# EAGLE design stuffed_teensy_ss (EAGLE 9.5.2)
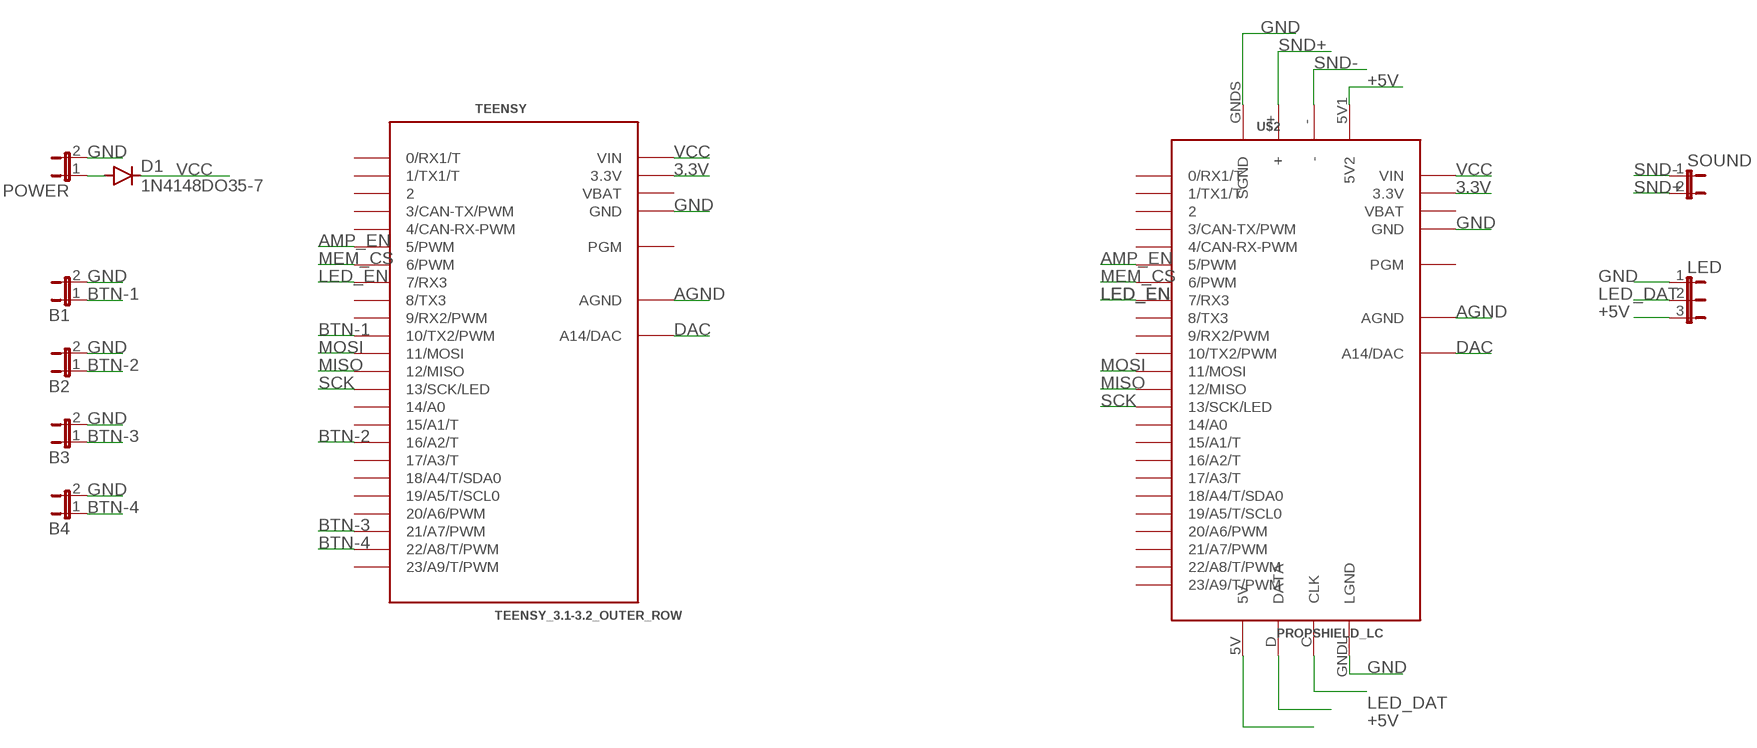
[diagram p0: schematic, sheet 1]

## Parts
B1  JP1E  [JP1]
B2  JP1E  [JP1]
B3  JP1E  [JP1]
B4  JP1E  [JP1]
D1  1N4148DO35-7  [DO35-7]
LED  JP2E  [JP2]
POWER  JP1E  [JP1]
SOUND  JP1E  [JP1]
TEENSY  TEENSY_3.1-3.2_OUTER_ROW  [TEENSY_3.0-3.2&LC_OUTER_ROW]
U$2  PROPSHIELD_LC  [TEENSY_PROPSHIELD_LC]

## Nets
3.3V: TEENSY.3.3V TEENSY.3.3V1(3.3V) U$2.3.3V U$2.3.3V1(3.3V)
+5V: LED.3 U$2.5V U$2.5V1(5V2)
AGND: TEENSY.AGND U$2.AGND
AMP_EN: TEENSY.5(5/PWM) U$2.5(5/PWM)
BTN-1: B1.1 TEENSY.10(10/TX2/PWM)
BTN-2: B2.1 TEENSY.16/A2(16/A2/T)
BTN-3: B3.1 TEENSY.21/A7(21/A7/PWM)
BTN-4: B4.1 TEENSY.22/A8(22/A8/T/PWM)
DAC: TEENSY.RESET/DAC(A14/DAC) U$2.RESET/DAC(A14/DAC)
GND: B1.2 B2.2 B3.2 B4.2 LED.1 POWER.2 TEENSY.GND TEENSY.GND1(GND) U$2.GND U$2.GND1(GND) U$2.GNDL(LGND) U$2.GNDS(SGND)
LED_DAT: LED.2 U$2.D(DATA)
LED_EN: TEENSY.7(7/RX3) U$2.7(7/RX3)
MEM_CS: TEENSY.6(6/PWM) U$2.6(6/PWM)
MISO: TEENSY.12(12/MISO) U$2.12(12/MISO)
MOSI: TEENSY.11(11/MOSI) U$2.11(11/MOSI)
N$6: U$2.C(CLK)
SCK: TEENSY.13(13/SCK/LED) U$2.13(13/SCK/LED)
SND+: SOUND.2 U$2.+
SND-: SOUND.1 U$2.-
VCC: D1.C TEENSY.VIN U$2.VIN
VCC_: D1.A POWER.1
Unconnected: TEENSY.0(0/RX1/T) TEENSY.1(1/TX1/T) TEENSY.2 TEENSY.3(3/CAN-TX/PWM) TEENSY.4(4/CAN-RX-PWM) TEENSY.8(8/TX3) TEENSY.9(9/RX2/PWM) TEENSY.14/A0 TEENSY.15/A1(15/A1/T) TEENSY.17/A3(17/A3/T) TEENSY.18/A4(18/A4/T/SDA0) TEENSY.19/A5(19/A5/T/SCL0) TEENSY.20/A6(20/A6/PWM) TEENSY.23/A9(23/A9/T/PWM) TEENSY.PGM U$2.0(0/RX1/T) U$2.1(1/TX1/T) U$2.2 U$2.3(3/CAN-TX/PWM) U$2.4(4/CAN-RX-PWM) U$2.8(8/TX3) U$2.9(9/RX2/PWM) U$2.10(10/TX2/PWM) U$2.14/A0 U$2.15/A1(15/A1/T) U$2.16/A2(16/A2/T) U$2.17/A3(17/A3/T) U$2.18/A4(18/A4/T/SDA0) U$2.19/A5(19/A5/T/SCL0) U$2.20/A6(20/A6/PWM) U$2.21/A7(21/A7/PWM) U$2.22/A8(22/A8/T/PWM) U$2.23/A9(23/A9/T/PWM) U$2.PGM

## Power pins joined to a net without a drawn wire
VBAT: TEENSY.VBAT U$2.VBAT

## Library data of the parts
B1-B4 POWER SOUND = jumper:JP1E: JUMPER
D1 = diode:1N4148: DIODE high speed (Philips)
LED = jumper:JP2E: JUMPER
TEENSY = Teensy_3_and_LC_Series_Boards_v1.4:TEENSY_3.1-3.2_OUTER_ROW: Footprint for Teensy 3.1 or 3.2 board using all pin connections on the outer perimeter
U$2 = Teensy_3_and_LC_Series_Board_v1.04 EDIT:PROPSHIELD_LC

## Board
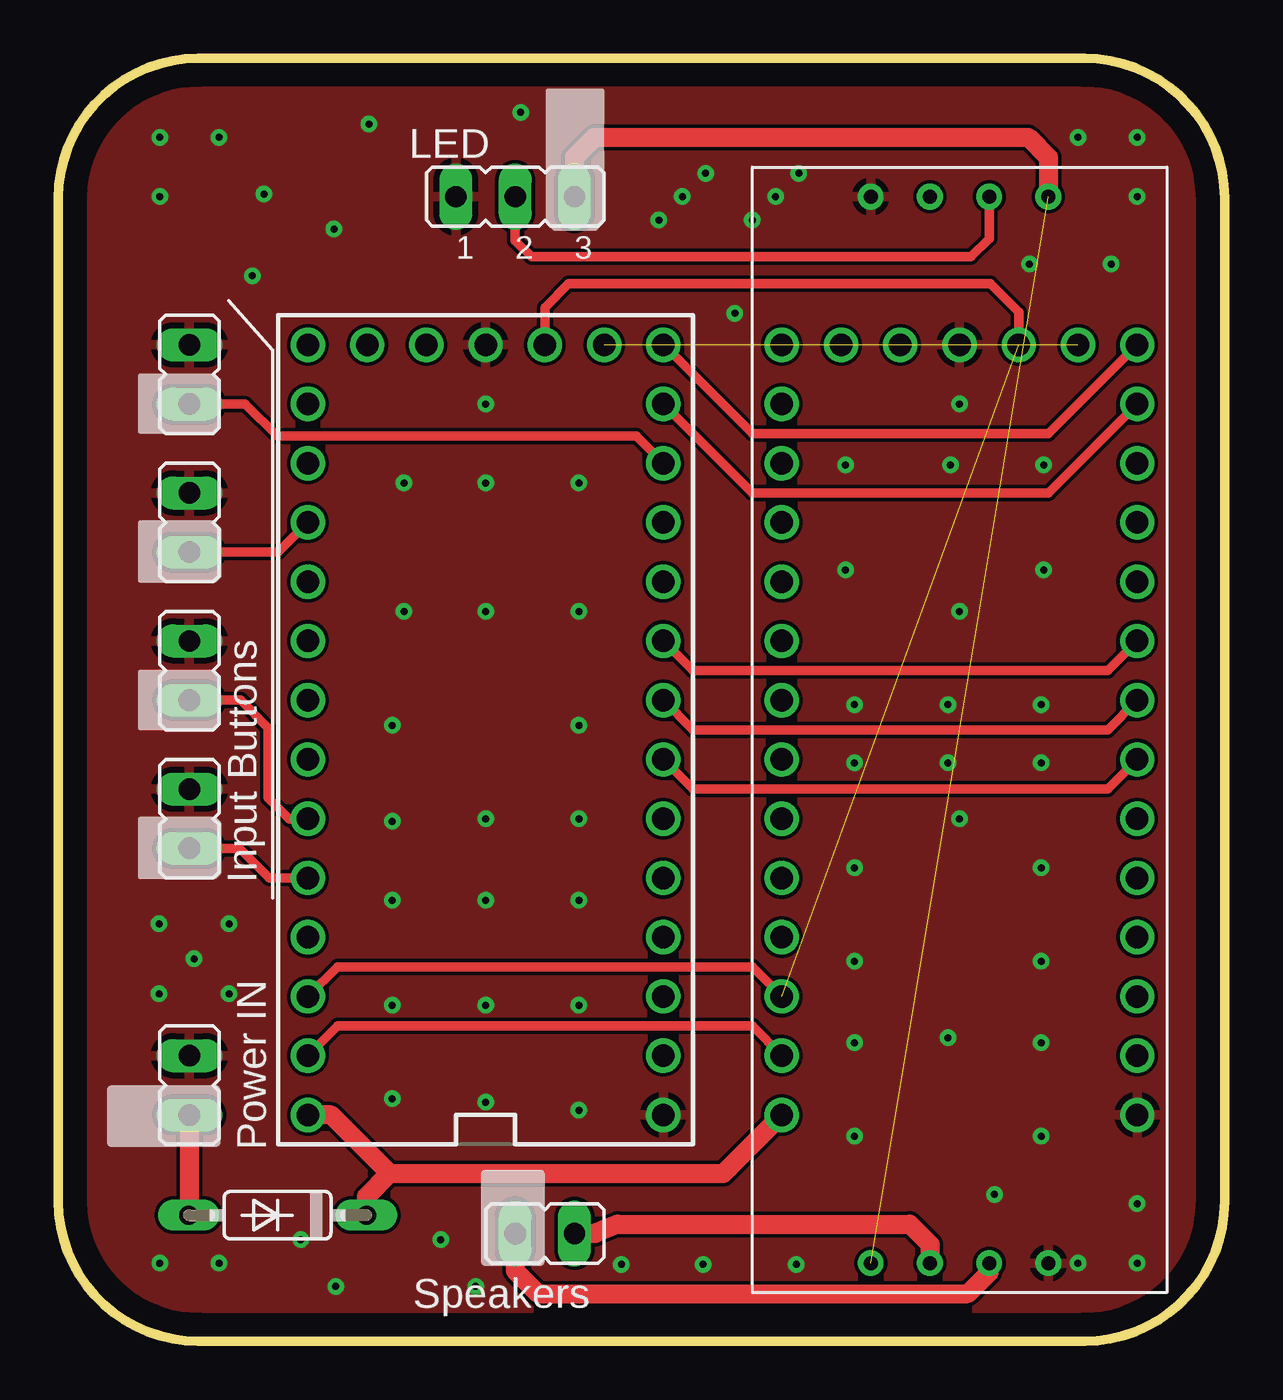
[diagram p1: board, top side]
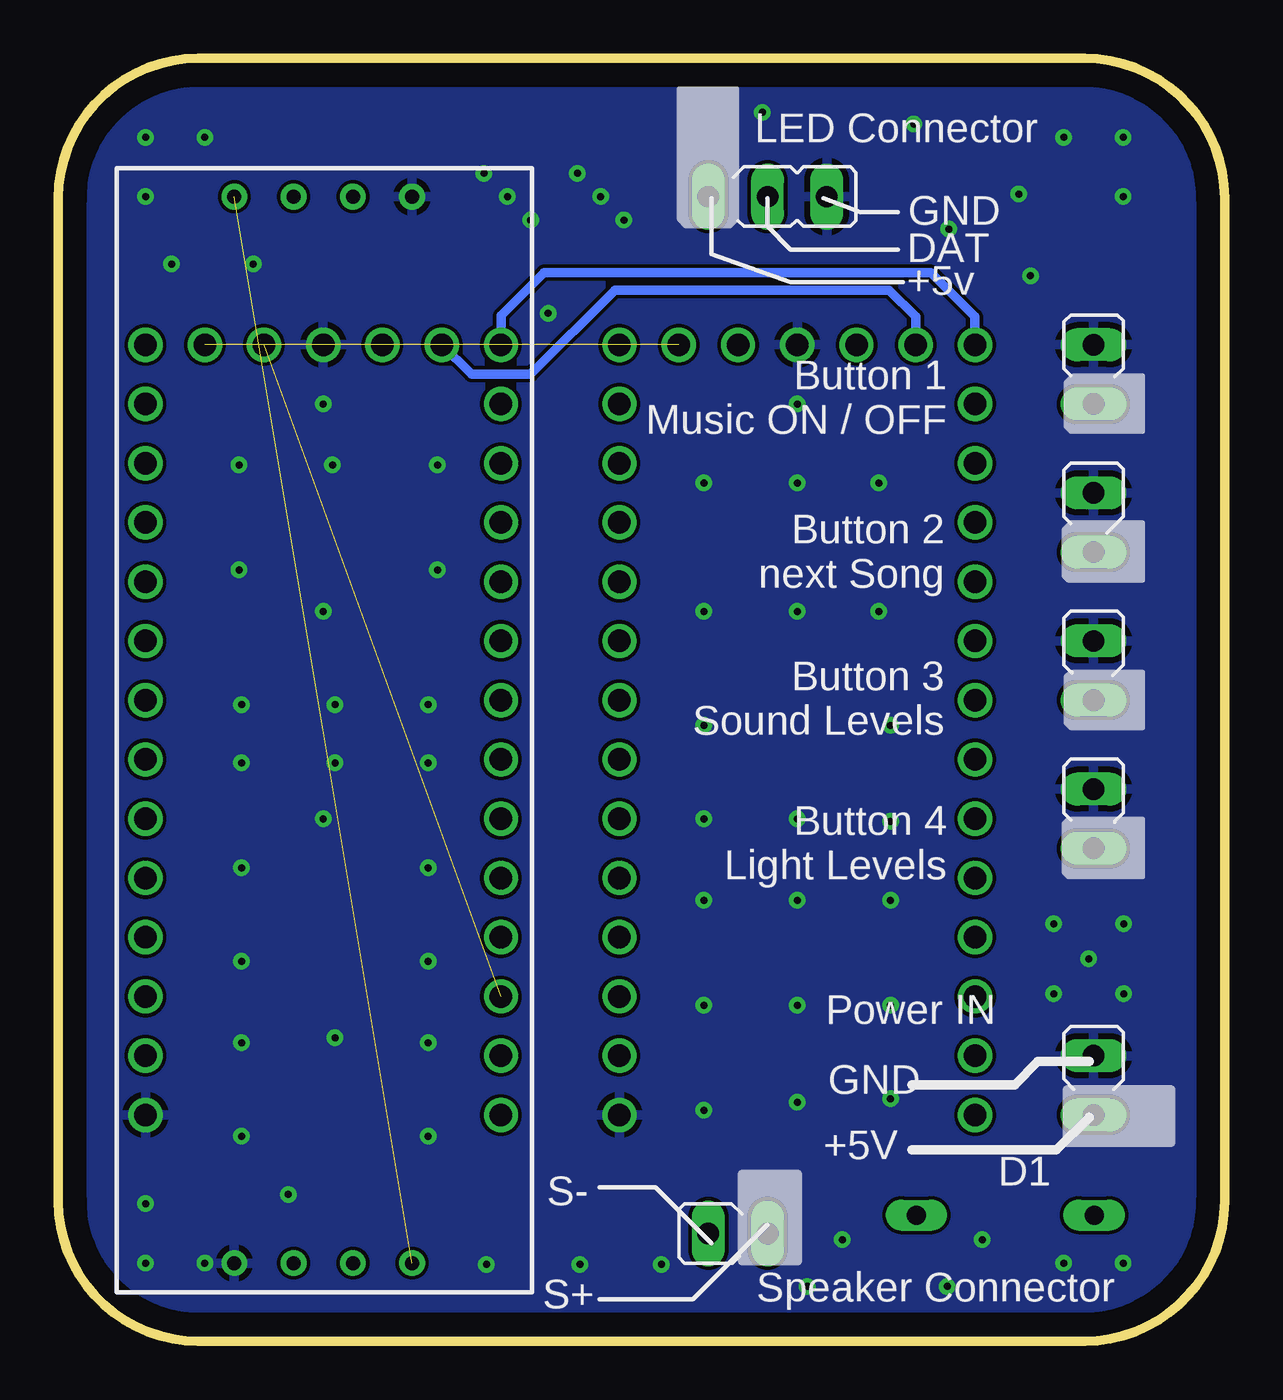
[diagram p2: board, bottom side, seen from below]

Size 50 x 55 mm. Coordinates in mm from the lower left corner, seen from the top.
Outline: 0,49 0,6 arc90 6,0 44,0 arc90 50,6 50,49 arc90 44,55 6,55 arc90 0,49
Copper layers (1*16): Top 0.035mm / dielectric 1.5mm / Bottom 0.035mm
Design rules "default *": minimum track width 6mil, minimum drill 0.3mm, track to track 6mil, track to pad 6mil, pad to pad 6mil, via to via 6mil, smd to smd 6mil, copper to edge 40mil, drill to drill 6mil, minimum pad ring 10mil, minimum via ring 8mil, stop-mask expansion 4mil, vias tented up to drill 0.4mm, thermal gap 10mil

### Footprints (pad centres in the part's own frame; a part is rotated, then mirrored left to right if it is on the bottom)
JP1 = drill 0.914 long: 1 0,-1.27; 2 0,1.27
DO35-7 = drill 0.813 long: A 3.81,0; C -3.81,0
JP2 = drill 0.914 long: 1 -2.54,0; 2 0,0; 3 2.54,0
TEENSY_3.0-3.2&LC_OUTER_ROW = drill 0.965: 0 -7.62,13.97; 1 -7.62,11.43; 2 -7.62,8.89; 3 -7.62,6.35; 3.3V 7.62,11.43; 3.3V1 -2.54,-16.51; 4 -7.62,3.81; 5 -7.62,1.27; 6 -7.62,-1.27; 7 -7.62,-3.81; 8 -7.62,-6.35; 9 -7.62,-8.89; 10 -7.62,-11.43; 11 -7.62,-13.97; 12 -7.62,-16.51; 13 7.62,-16.51; 14/A0 7.62,-13.97; 15/A1 7.62,-11.43; 16/A2 7.62,-8.89; 17/A3 7.62,-6.35; 18/A4 7.62,-3.81; 19/A5 7.62,-1.27; 20/A6 7.62,1.27; 21/A7 7.62,3.81; 22/A8 7.62,6.35; 23/A9 7.62,8.89; AGND 7.62,13.97; GND -7.62,16.51; GND1 0,-16.51; PGM 2.54,-16.51; RESET/DAC 5.08,-16.51; VBAT -5.08,-16.51; VIN 7.62,16.51
TEENSY_PROPSHIELD_LC = drill 0.965: 0 -7.62,13.97; 1 -7.62,11.43; 2 -7.62,8.89; 3 -7.62,6.35; 3.3V 7.62,11.43; 3.3V1 -2.54,-16.51; 4 -7.62,3.81; 5 -7.62,1.27; 6 -7.62,-1.27; 7 -7.62,-3.81; 8 -7.62,-6.35; 9 -7.62,-8.89; 10 -7.62,-11.43; 11 -7.62,-13.97; 12 -7.62,-16.51; 13 7.62,-16.51; 14/A0 7.62,-13.97; 15/A1 7.62,-11.43; 16/A2 7.62,-8.89; 17/A3 7.62,-6.35; 18/A4 7.62,-3.81; 19/A5 7.62,-1.27; 20/A6 7.62,1.27; 21/A7 7.62,3.81; 22/A8 7.62,6.35; 23/A9 7.62,8.89; AGND 7.62,13.97; GND -7.62,16.51; GND1 0,-16.51; PGM 2.54,-16.51; RESET/DAC 5.08,-16.51; VBAT -5.08,-16.51; VIN 7.62,16.51 | drill 0.6: 5V -3.81,-22.86; 5V1 3.81,22.86; + -1.27,22.86; - 1.27,22.86; C 1.27,-22.86; D -1.27,-22.86; GNDL 3.81,-22.86; GNDS -3.81,22.86

### Placement (x,y rotation side)
B1  5.62,41.45 0 top
B2  5.62,35.1 0 top
B3  5.62,28.75 0 top
B4  5.62,22.4 0 top
D1  9.4,5.4 180 top
LED  19.59,49.07 0 top
POWER  5.62,10.97 0 top
SOUND  20.86,4.62 90 top
TEENSY  18.32,26.21 180 top
U$2  38.64,26.21 180 top

### Tracks (layer width: path | path; a pad name or v marks a point on that pad's centre or on a via)
3.3V  (1 unrouted)
  Top 0.406: TEENSY.3.3V 11.97,16.05 29.75,16.05 U$2.3.3V | TEENSY.3.3V1 20.86,44.32 21.87,45.33 39.97,45.33 41.18,44.12 U$2.3.3V1
+5V  (1 unrouted)
  Top 0.813: LED.3 22.13,50.74 23,51.61 41.58,51.61 42.45,50.74 U$2.5V
AGND
  Top 0.406: U$2.AGND 29.75,13.51 11.97,13.51 TEENSY.AGND
AMP_EN
  Top 0.406: TEENSY.5 27.21,23.67 44.99,23.67 U$2.5
BTN-1
  Top 0.406: B1.1 8.02,40.18 9.4,38.8 24.78,38.8 TEENSY.10
BTN-2
  Top 0.406: B2.1 9.43,33.83 TEENSY.16/A2
BTN-3
  Top 0.406: B3.1 7.82,27.48 9,26.3 9,23.3 9.9,22.4 TEENSY.21/A7
BTN-4
  Top 0.406: B4.1 7.77,21.13 9.04,19.86 TEENSY.22/A8
DAC
  Bottom 0.406: U$2.RESET/DAC 32.29,41.45 29.75,41.45 26.14,45.06 14.38,45.06 13.24,43.92 TEENSY.RESET/DAC
GND  (via drill 0.3 pad 0.6)
  other vias: 4.35,3.35 6.89,3.35 43.72,3.35 46.26,3.35 46.26,5.89 38.14,13.01 38.64,22.4 38.64,31.29 38.64,40.18 43.72,51.61 46.26,51.61 46.26,49.07 6.89,51.61 4.35,51.61 4.35,49.07 18.32,40.18 18.32,31.29 18.32,22.4 18.32,10.24 30.75,49.07 26.75,49.07 33.75,37.57 42.25,37.57 34.14,27.29 42.14,27.29 42.14,24.79 34.14,24.79 14.32,14.4 18.32,14.4 22.32,14.4 41.64,46.18 45.14,46.18 11.82,47.68 8.32,45.68 5.82,16.4 14.82,31.29 22.32,31.29 14.32,22.29 22.32,22.4 18.32,18.9 14.32,18.9 22.32,18.9 14.32,26.4 22.32,26.4 14.82,36.79 18.32,36.79 22.32,36.79 33.75,33.07 42.25,33.07 34.14,20.29 34.14,16.29 34.14,12.79 34.14,8.79 42.14,20.29 42.14,16.29 42.14,12.79 42.14,8.79 14.32,10.4 22.32,9.9 16.39,4.35 11.89,2.35 40.14,6.29 8.82,49.18 13.32,52.18 19.82,52.68 29.75,48.07 31.75,50.07 27.75,50.07 25.75,48.07 38.25,37.57 38.14,27.29 38.14,24.79 31.64,3.29 27.64,3.29 24.14,3.29 4.32,14.9 7.32,17.9 7.32,14.9 4.32,17.9 10.39,4.35 17.89,2.35 29,44.07
  pour Top: -0.73,56.69 51.34,56.69 51.34,-1.73 -0.73,-1.73
  pour Bottom: 0.54,55.42 50.07,55.42 50.07,-0.46 0.54,-0.46
LED_DAT
  Top 0.406: U$2.D 39.91,47.27 39.13,46.49 20.29,46.49 19.59,47.19 LED.2
LED_EN
  Top 0.406: TEENSY.7 27.21,28.75 44.99,28.75 U$2.7
MEM_CS
  Top 0.406: U$2.6 44.99,26.21 27.21,26.21 TEENSY.6
MISO
  Top 0.406: TEENSY.12 29.75,38.91 42.45,38.91 U$2.12
MOSI
  Top 0.406: TEENSY.11 29.75,36.37 42.45,36.37 U$2.11
SCK
  Bottom 0.406: U$2.13 31.02,43.97 29.17,45.82 12.59,45.82 10.7,43.92 TEENSY.13
SND+
  Top 0.813: SOUND.2 19.59,3.02 20.58,2.03 38.99,2.03 39.91,2.95 U$2.+
SND-
  Top 0.813: SOUND.1 23.01,4.62 23.98,5.02 36.5,5.02 37.37,4.15 U$2.-
VBAT  (1 unrouted)
VCC
  Top 0.813: 14.21,7.19 11.7,9.7 TEENSY.VIN | D1.C 13.21,6.19 14.21,7.19 | 14.21,7.19 28.51,7.19 U$2.VIN
VCC_
  Top 0.813: POWER.1 5.62,5.43 D1.A

### Text on the board
tPlace: LED | Input Buttons | Power IN | Speakers
bPlace: LED Connector | GND | DAT | +5v | Button 1 / Music ON / OFF | Button 2 / next Song | Button 3 / Sound Levels | Button 4 / Light Levels | Power IN | GND | +5V | S- | Speaker Connector | S+